# Altium project PCB_Project_SFP_Rigid.PrjPcb
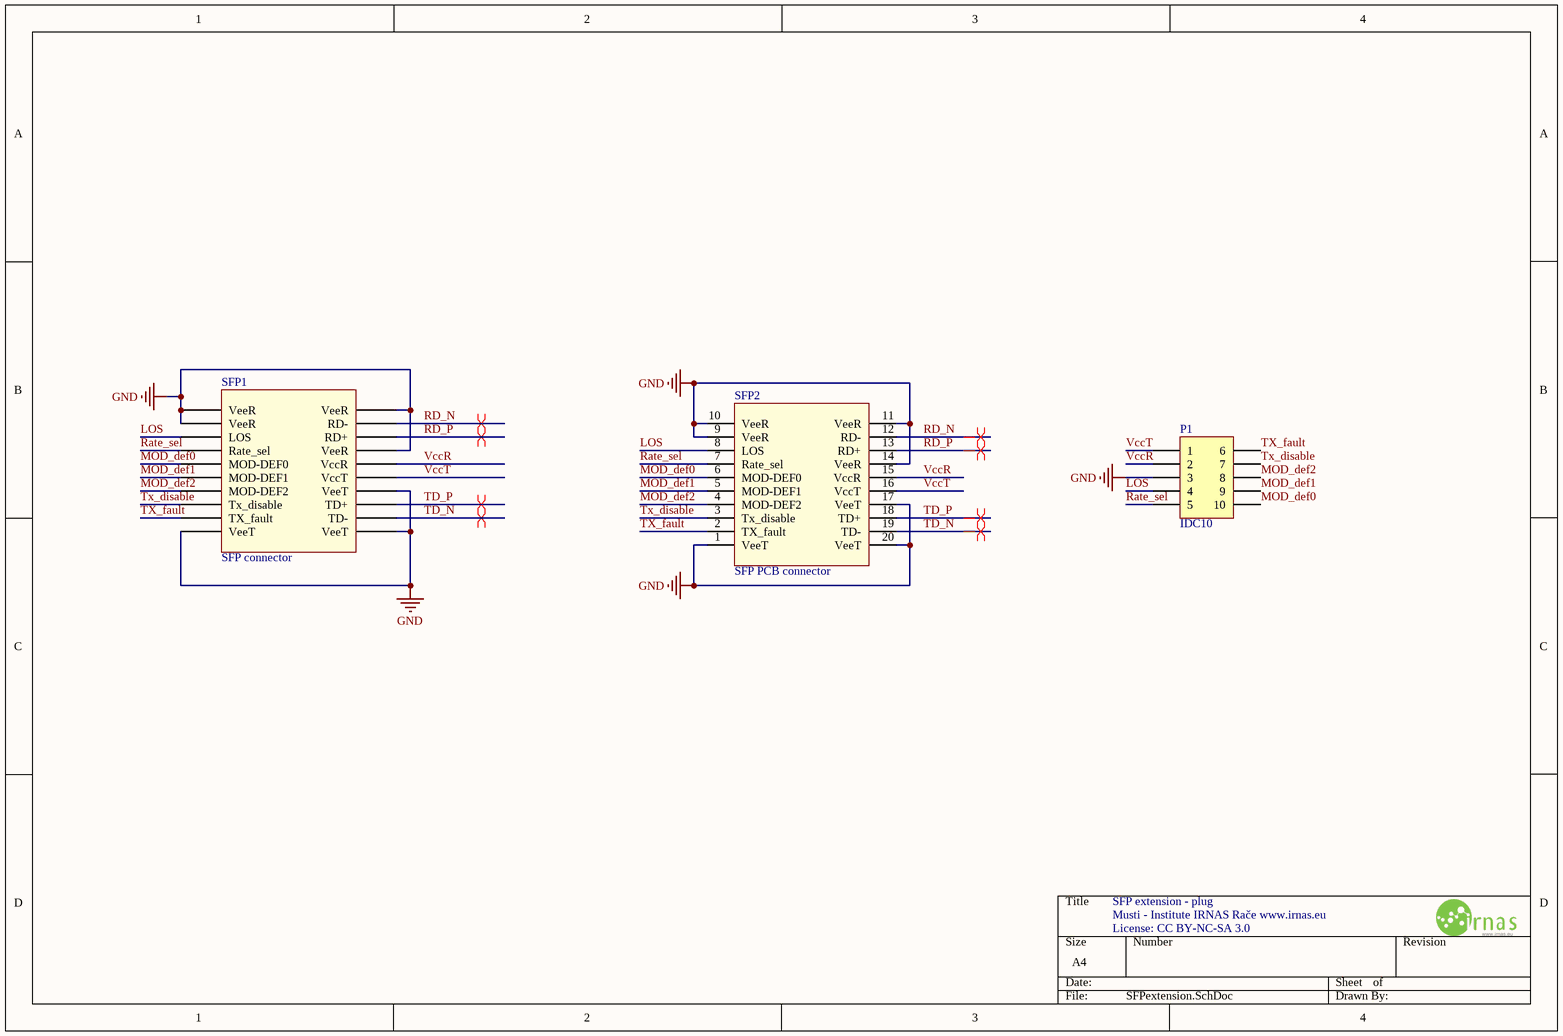
[diagram p0: SFPextension.SchDoc]
1 sheet, 3 parts. Net scope: global (net labels, ports and power ports of the same name join across sheets).
Board file: SFPextension.PcbDoc

## Sheet SFPextension.SchDoc
size A4

### Parts
P1  IDC10  [HDR2X5_CEN]
SFP1  SFP connector  [SFP pcb con]
SFP2  SFP PCB connector  [SFP pcb con solder]

### Nets
GND: P1.3 SFP1.1(VeeT) SFP1.9(VeeR) SFP1.10(VeeR) SFP1.11(VeeR) SFP1.14(VeeR) SFP1.17(VeeT) SFP1.20(VeeT) SFP2.1(VeeT) SFP2.9(VeeR) SFP2.10(VeeR) SFP2.11(VeeR) SFP2.14(VeeR) SFP2.17(VeeT) SFP2.20(VeeT)
LOS: P1.4 SFP1.8(LOS) SFP2.8(LOS)
MOD_def0: P1.10 SFP1.6(MOD-DEF0) SFP2.6(MOD-DEF0)
MOD_def1: P1.9 SFP1.5(MOD-DEF1) SFP2.5(MOD-DEF1)
MOD_def2: P1.8 SFP1.4(MOD-DEF2) SFP2.4(MOD-DEF2)
Rate_sel: P1.5 SFP1.7(Rate_sel) SFP2.7(Rate_sel)
RD_N: SFP1.12(RD-) SFP2.12(RD-)
RD_P: SFP1.13(RD+) SFP2.13(RD+)
TD_N: SFP1.19(TD-) SFP2.19(TD-)
TD_P: SFP1.18(TD+) SFP2.18(TD+)
Tx_disable: P1.7 SFP1.3(Tx_disable) SFP2.3(Tx_disable)
TX_fault: P1.6 SFP1.2(TX_fault) SFP2.2(TX_fault)
VccR: P1.2 SFP1.15(VccR) SFP2.15(VccR)
VccT: P1.1 SFP1.16(VccT) SFP2.16(VccT)

### Layout directives
differential pair: RD_N, RD_P, TD_N, TD_P

### Notes on the sheet
- SFP extension - plug
- Musti - Institute IRNAS Rače www.irnas.eu
- License: CC BY-NC-SA 3.0

### Library data of the parts
P1 = Header 5X2A: Header, 5-Pin, Dual row